# Altium schematic sheet JTAG&Trace.SchDoc: JTAG & Trace
size A4; DocumentNumber: MB1167; Revision: B.1; SheetNumber: 17; SheetTotal: 17; Project: STM327x6G-EVAL
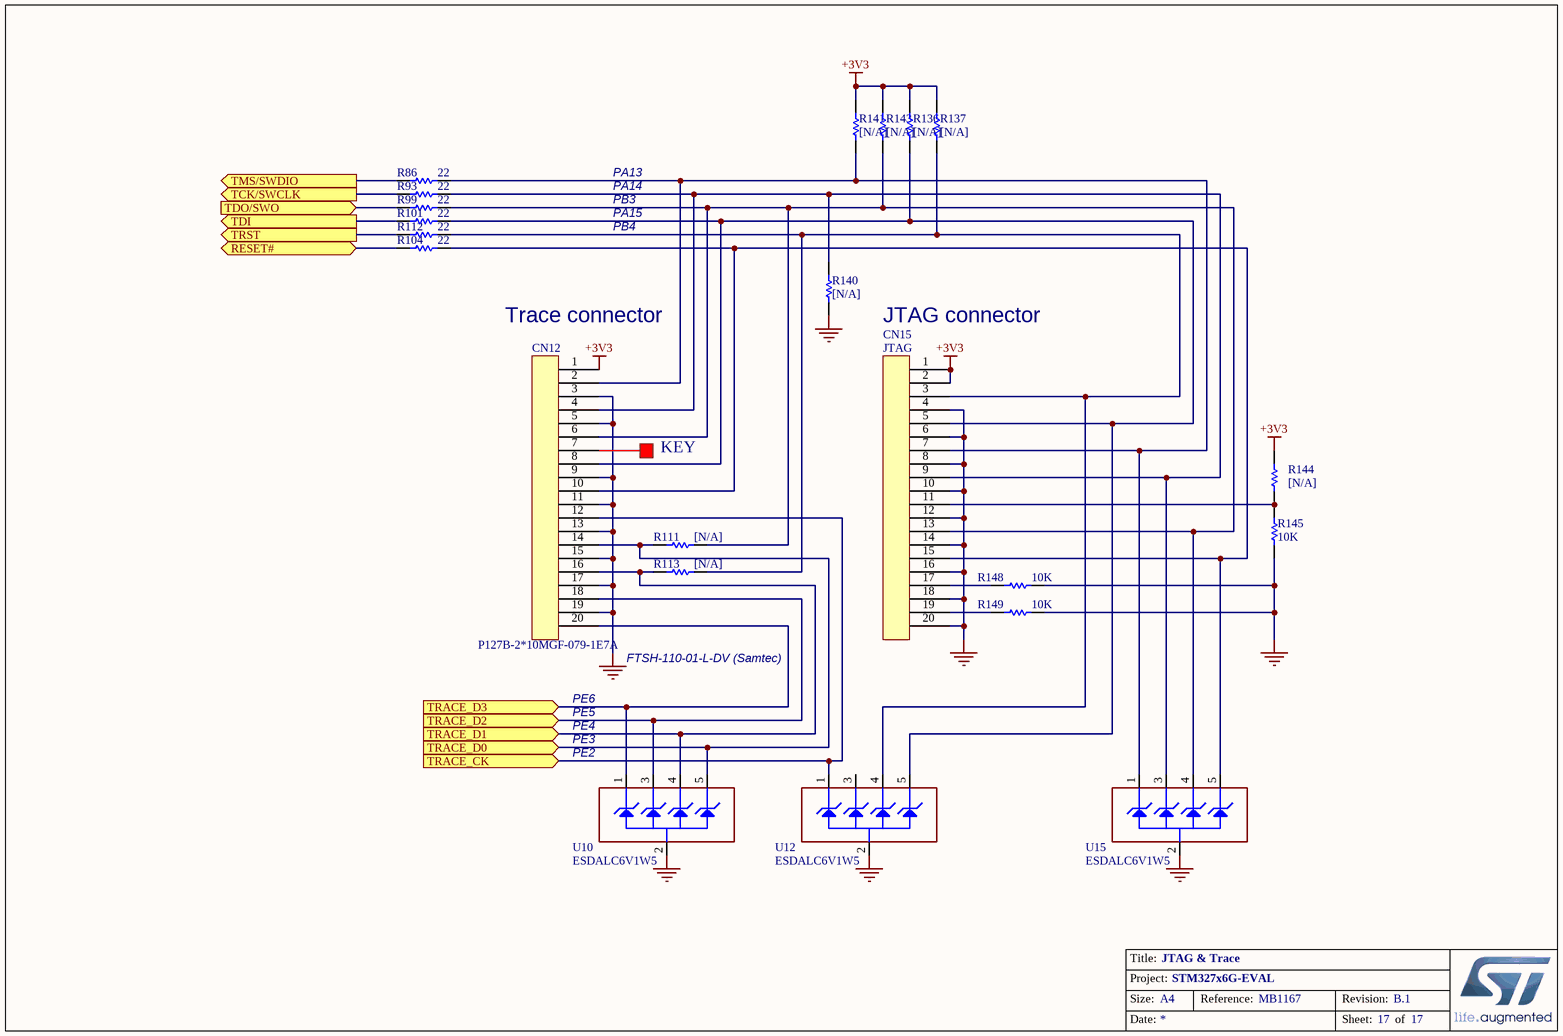
[diagram p0: JTAG&Trace.SchDoc]

## Parts
CN12  P127B-2*10MGF-079-1E7A  [FTSH-110-01-L-DV]
CN15  JTAG  [IDC20S]
R86  22  [0603R]
R93  22  [0603R]
R99  22  [0603R]
R101  22  [0603R]
R104  22  [0603R]
R111  [N/A]  [0603R]
R112  22  [0603R]
R113  [N/A]  [0603R]
R136  [N/A]  [0603R]
R137  [N/A]  [0603R]
R140  [N/A]  [0603R]
R141  [N/A]  [0603R]
R143  [N/A]  [0603R]
R144  [N/A]  [0603R]
R145  10K  [0603R]
R148  10K  [0603R]
R149  10K  [0603R]
U10  ESDALC6V1W5  [SOT-353]
U12  ESDALC6V1W5  [SOT-353]
U15  ESDALC6V1W5  [SOT-353]

## Ports
RESET# (bidir), TCK/SWCLK (out), TDI (out), TDO/SWO (in), TMS/SWDIO (out), TRACE_CK (in), TRACE_D0 (in), TRACE_D1 (in), TRACE_D2 (in), TRACE_D3 (in), TRST (out)

## Nets
+3V3: CN12.1 CN15.1 CN15.2 R136.2 R137.2 R141.2 R143.2 R144.2
GND: CN12.3 CN12.5 CN12.9 CN12.11 CN12.13 CN12.15 CN12.17 CN12.19 CN15.4 CN15.6 CN15.8 CN15.10 CN15.12 CN15.14 CN15.16 CN15.18 CN15.20 R140.1 R145.1 R148.1 R149.1 U10.2(GND) U12.2(GND) U15.2(GND)
RESET#: R104.2 ; port RESET#
TCK/SWCLK: R93.2 ; port TCK/SWCLK
TDI: R101.2 ; port TDI
TDO/SWO: R99.2 ; port TDO/SWO
TMS/SWDIO: R86.2 ; port TMS/SWDIO
TRACE_CK: CN12.12 U12.1(IO1) ; port TRACE_CK
TRACE_D0: CN12.14 R111.1 U10.5(IO4) ; port TRACE_D0
TRACE_D1: CN12.16 R113.1 U10.4(IO3) ; port TRACE_D1
TRACE_D2: CN12.18 U10.3(IO2) ; port TRACE_D2
TRACE_D3: CN12.20 U10.1(IO1) ; port TRACE_D3
TRST: R112.2 ; port TRST
NetCN12_2: CN12.2 CN15.7 R86.1 R141.1 U15.1(IO1)
NetCN12_4: CN12.4 CN15.9 R93.1 R140.2 U15.3(IO2)
NetCN12_6: CN12.6 CN15.13 R99.1 R111.2 R143.1 U15.4(IO3)
NetCN12_8: CN12.8 CN15.5 R101.1 R136.1 U12.5(IO4)
NetCN12_10: CN12.10 CN15.15 R104.1 U15.5(IO4)
NetCN15_3: CN15.3 R112.1 R113.2 R137.1 U12.4(IO3)
NetCN15_11: CN15.11 R144.1 R145.2
NetCN15_17: CN15.17 R148.2
NetCN15_19: CN15.19 R149.2

Not connected (* = marked no-connect by the designer): CN12 7; U12 3(IO2)

## Notes on the sheet
- PA13
- PA14
- PB3
- PA15
- PB4
- (near CN12) Trace connector
- JTAG connector
- KEY
- PE6
- PE5
- (near CN12) FTSH-110-01-L-DV (Samtec)
- PE4
- PE3
- (near U10) PE2
- Title:
- Project:
- Size:
- Date:
- A4
- Reference:
- Sheet:
- Revision:
- of

## Library data of the parts
CN12 CN15 = 20PIN1
R86 R93 R99 R101 R104 R111-R113 R136 R137 R140 R141 R143-R145 R148 R149 = Res1: Resistor; Value: 1K; Published: 8-Jun-2000; Revision: July-2002: Re-released for DXP Platform.; Publisher: Altium Limited
U10 U12 U15 = ESDALC6V1W5: Dual Transil array for ESD protection; Manuf_1: STM; Manuf_Part_1: ESDA5V3L; Ref St: 9179034; Provided: ST; ECCN_US/EU: EAR99/NEC; Distrib: ST; Order: ESDA5V3L; Ordered by: STM